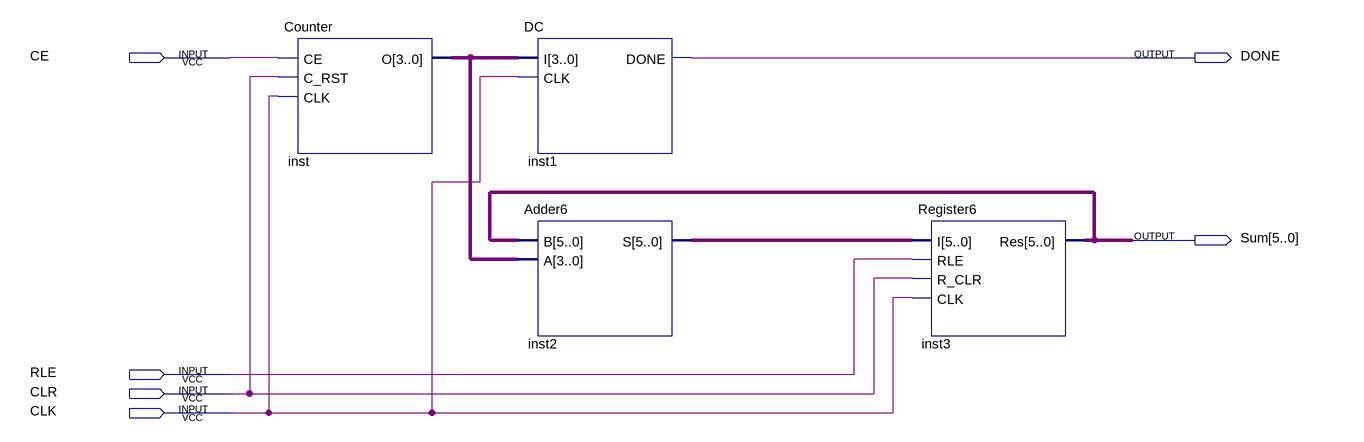
[diagram p0: schematic sheet]
// Quartus schematic Datapath.bdf as structural Verilog: 4 symbols, 6 pins
module Datapath (
  input  CE,
  input  RLE,
  input  CLR,
  input  CLK,
  output DONE,
  output [5:0] Sum
);

  wire [3:0] inst_o;
  wire [5:0] inst2_s;

  Counter inst (.CE(CE), .C_RST(CLR), .CLK(CLK), .O(inst_o));
  DC inst1 (.I(inst_o), .CLK(CLK), .DONE(DONE));
  Adder6 inst2 (.B(Sum), .A(inst_o), .S(inst2_s));
  Register6 inst3 (.I(inst2_s), .RLE(RLE), .R_CLR(CLR), .CLK(CLK), .Res(Sum));
endmodule
